# EAGLE design Relay board shield (EAGLE 9.2.0)
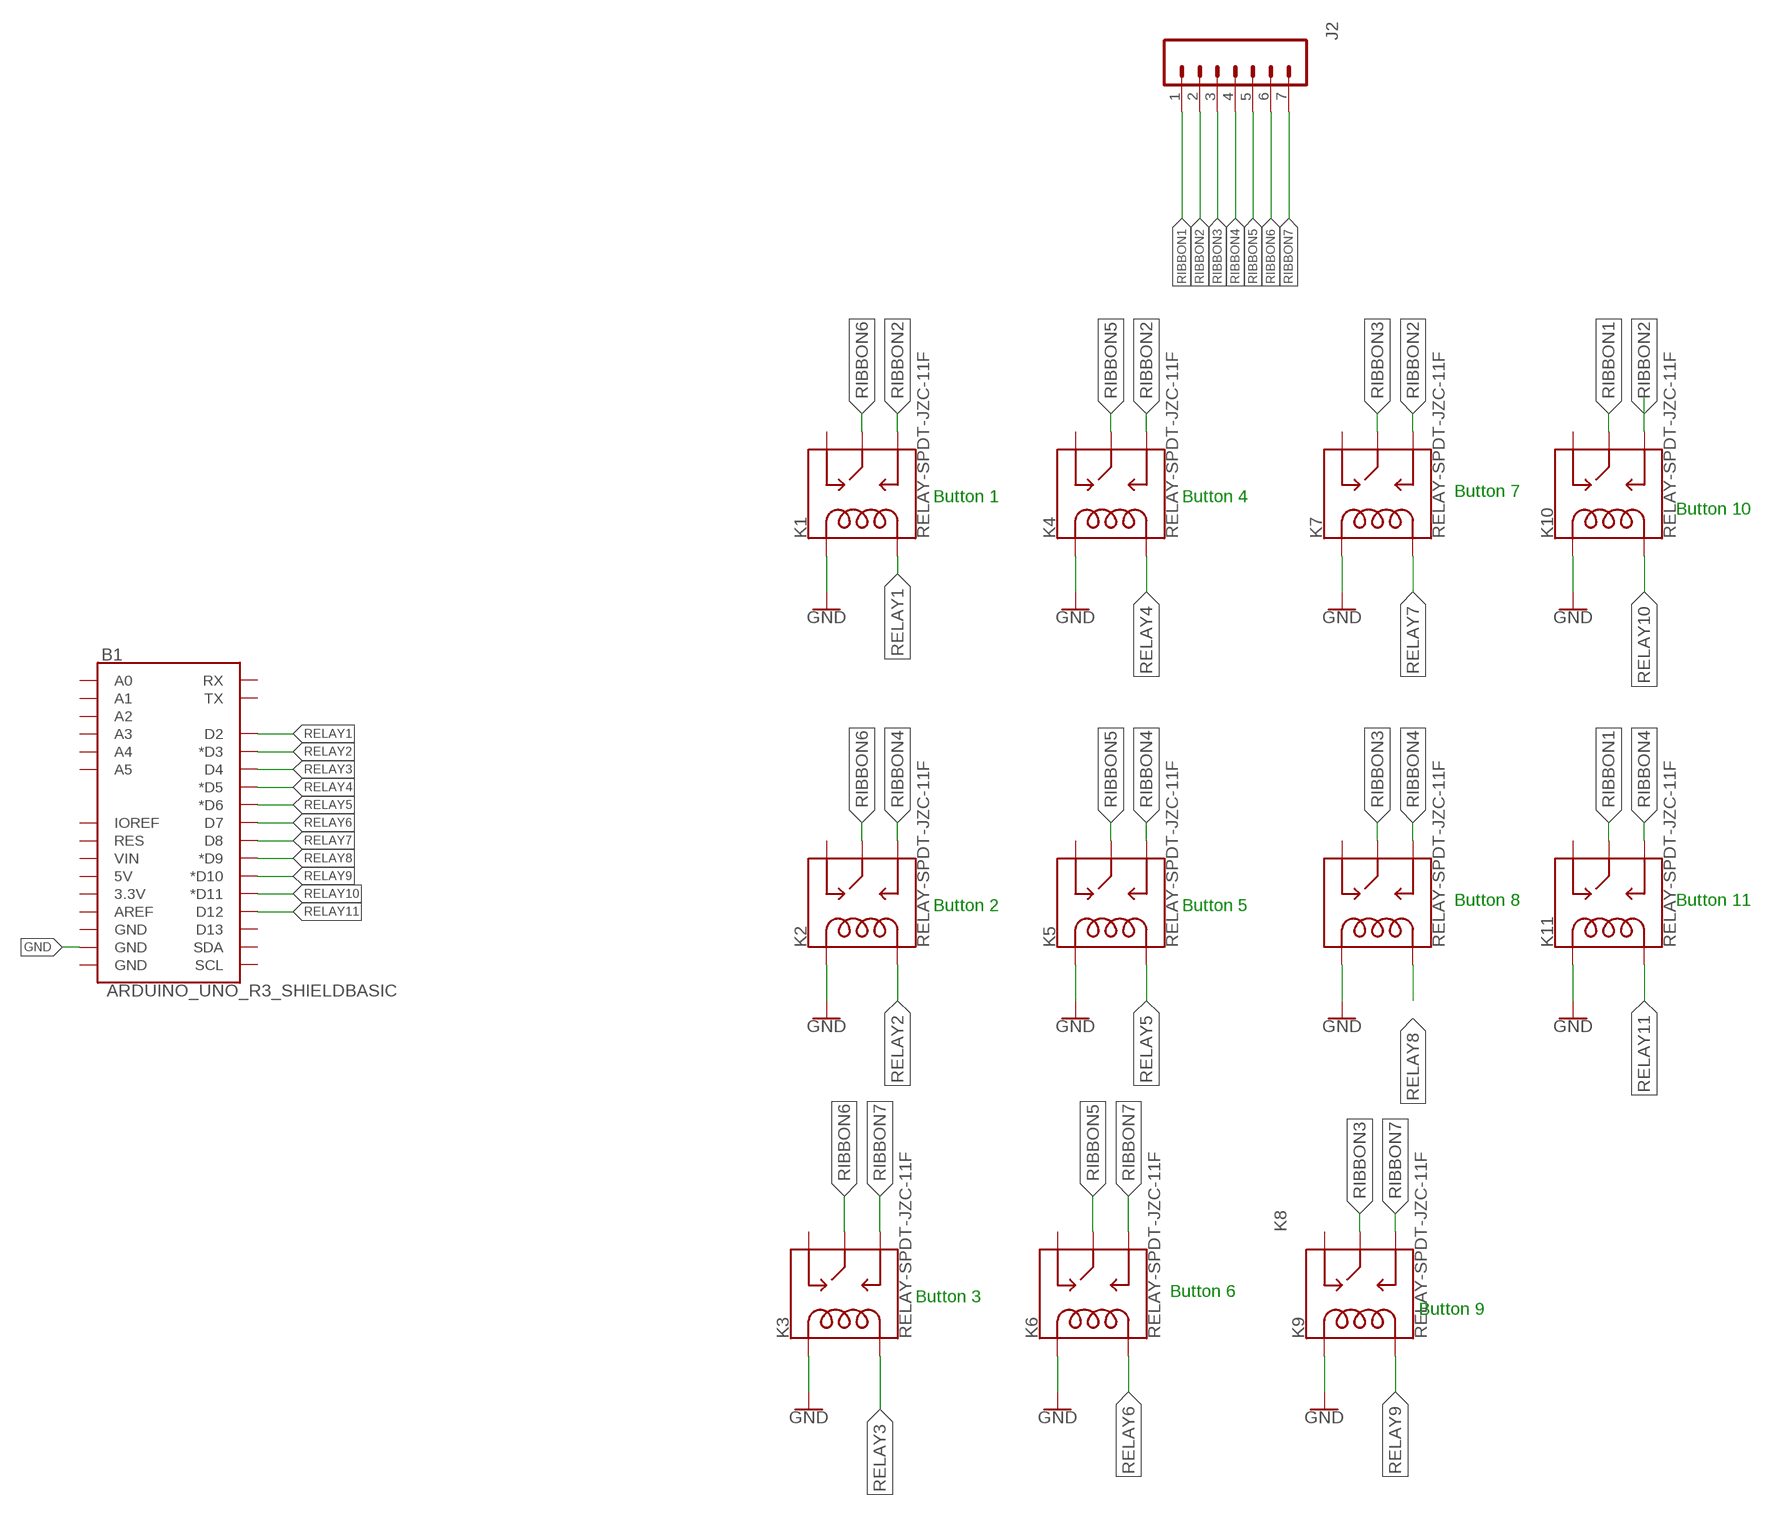
[diagram p0: schematic, sheet 1]

## Parts
B1  ARDUINO_UNO_R3_SHIELDBASIC  [UNO_R3_SHIELD]
J2  CONN_07  [1X07]
K1  RELAY-SPDT-JZC-11F  [RELAY-JZC]
K2  RELAY-SPDT-JZC-11F  [RELAY-JZC]
K3  RELAY-SPDT-JZC-11F  [RELAY-JZC]
K4  RELAY-SPDT-JZC-11F  [RELAY-JZC]
K5  RELAY-SPDT-JZC-11F  [RELAY-JZC]
K6  RELAY-SPDT-JZC-11F  [RELAY-JZC]
K7  RELAY-SPDT-JZC-11F  [RELAY-JZC]
K8  RELAY-SPDT-JZC-11F  [RELAY-JZC]
K9  RELAY-SPDT-JZC-11F  [RELAY-JZC]
K10  RELAY-SPDT-JZC-11F  [RELAY-JZC]
K11  RELAY-SPDT-JZC-11F  [RELAY-JZC]

## Nets
GND: B1.GND@1(GND) K1.5(COIL1) K2.5(COIL1) K3.5(COIL1) K4.5(COIL1) K5.5(COIL1) K6.5(COIL1) K7.5(COIL1) K8.5(COIL1) K9.5(COIL1) K10.5(COIL1) K11.5(COIL1)
RELAY1: B1.D2 K1.1(COIL2)
RELAY2: B1.D3(*D3) K2.1(COIL2)
RELAY3: B1.D4 K3.1(COIL2)
RELAY4: B1.D5(*D5) K4.1(COIL2)
RELAY5: B1.D6(*D6) K5.1(COIL2)
RELAY6: B1.D7 K6.1(COIL2)
RELAY7: B1.D8 K7.1(COIL2)
RELAY8: B1.D9(*D9) K8.1(COIL2)
RELAY9: B1.D10(*D10) K9.1(COIL2)
RELAY10: B1.D11(*D11) K10.1(COIL2)
RELAY11: B1.D12 K11.1(COIL2)
RIBBON1: J2.1 K10.4(MAIN) K11.4(MAIN)
RIBBON2: J2.2 K1.3(NO) K4.3(NO) K7.3(NO) K10.3(NO)
RIBBON3: J2.3 K7.4(MAIN) K8.4(MAIN) K9.4(MAIN)
RIBBON4: J2.4 K2.3(NO) K5.3(NO) K8.3(NO) K11.3(NO)
RIBBON5: J2.5 K4.4(MAIN) K5.4(MAIN) K6.4(MAIN)
RIBBON6: J2.6 K1.4(MAIN) K2.4(MAIN) K3.4(MAIN)
RIBBON7: J2.7 K3.3(NO) K6.3(NO) K9.3(NO)
Unconnected: B1.3.3V B1.5V B1.A0 B1.A1 B1.A2 B1.A3 B1.A4 B1.A5 B1.AREF B1.D13 B1.GND@0(GND) B1.GND@2(GND) B1.IOREF B1.RES B1.RX B1.SCL B1.SDA B1.TX B1.VIN K1.2(NC) K2.2(NC) K3.2(NC) K4.2(NC) K5.2(NC) K6.2(NC) K7.2(NC) K8.2(NC) K9.2(NC) K10.2(NC) K11.2(NC)

## Notes on the sheet
- Button 7
- Button 1 | Button 4 | Button 10
- Button 8 | Button 11
- Button 2 | Button 5
- Button 6
- Button 3 | Button 9

## Library data of the parts
B1 = SparkFun-Boards:ARDUINO_UNO_R3_SHIELD: Arduino R3 Shield Footprint Shield form compatible with the Arduino Uno R3. SparkFun Products: MG2639 Cellular Shield <https://www.sparkfun.com/products/13120> MIDI Shield <https://www.sparkfun.com/products/12898> R3 Stackable Headers Kit <https://www.sparkfun.com/products/11417>
J2 = SparkFun-Connectors:CONN_07: Multi connection point. Often used as Generic Header-pin footprint for 0.1 inch spaced/style header connections On any of the 0.1 inch spaced packages, you can populate with these: Break Away Headers - Straight <https://www.sparkfun.com/products/116> (PRT-00116) Break Away Male Headers - Right Angle <https://www.sparkfun.com/products/553> (PRT-00553) Female Headers <https://www.sparkfun.com/products/115> (PRT-00115) Break Away Headers - Machine Pin <https://www.sparkfun.com/products/117> (PRT-00117) Break Away Female Headers - Swiss Machine Pin <https://www.sparkfun.com/products/743> (PRT-00743) For SCREWTERMINALS and SPRING TERMINALS visit here: Screw Terimnals on SparkFun.com <https://www.sparkfun.com/search/results?term=Screw+Terminals> (5mm/3.5mm/2.54mm spacing) This device is also useful as a general connection point to wire up your design to another part of your project. Our various solder wires solder well into these plated through hole pads. Hook-Up Wire - Assortment (Stranded, 22 AWG) <https://www.sparkfun.com/products/11375> (PRT-11375) Hook-Up Wire - Assortment (Solid Core, 22 AWG) <https://www.sparkfun.com/products/11367> (PRT-11367) View the entire wire category on our website here <https://www.sparkfun.com/categories/141> Special notes: Molex polarized connector foot print use with SKU : PRT-08231 with associated crimp pins and housings. 1MM SMD Version SKU: PRT-10208 NOTES ON THE VARIANTS LOCK and LOCK_LONGPADS... This footprint was designed to help hold the alignment of a through-hole component (i.e. 6-pin header) while soldering it into place. You may notice that each hole has been shifted either up or down by 0.005 of an inch from it's more standard position (which is a perfectly straight line). This slight alteration caused the pins (the squares in the middle) to touch the edges of the holes. Because they are alternating, it causes a "brace" to hold the component in place. 0.005 has proven to be the perfect amount of "off-center" position when using our standard breakaway headers. Although looks a little odd when you look at the bare footprint, once you have a header in there, the alteration is very hard to notice. Also,if you push a header all the way into place, it is covered up entirely on the bottom side.
K1-K11 = SparkFun-Electromechanical:RELAY-SPDT: SPDT Electromechanical Relay Single-pole, double-throw sealed relays. When current is applied to the coil, it throws a simple changeover switch, terminating the connection from the NC contact to ground and closing the NO contact. Use them to switch high voltage/high current devices. SparkFun Products JQX-15F: Relay SPDT Sealed - 20A <https://www.sparkfun.com/products/10924> (COM-10924) JZC-11F: Relay SPDT Sealed <https://www.sparkfun.com/products/100> (COM-00100); PROD_ID: COMP-09533; SF_SKU: COM-00100

## Board
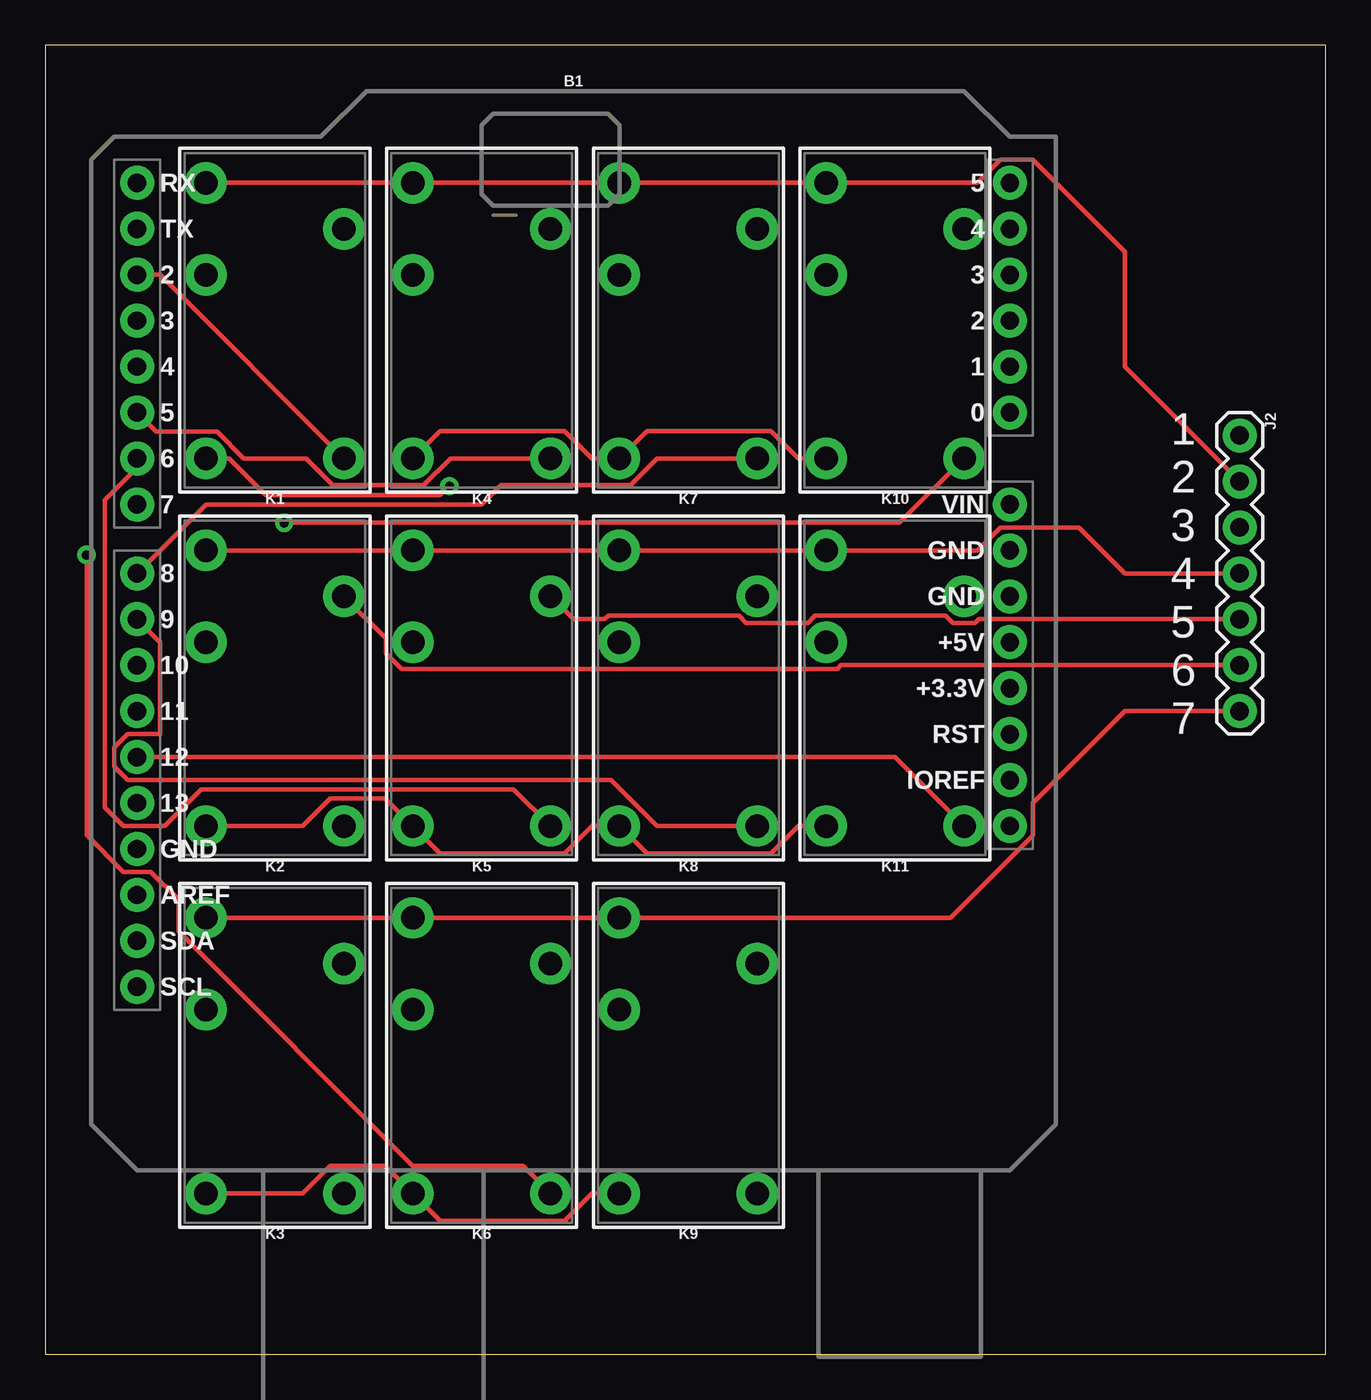
[diagram p1: board, top side]
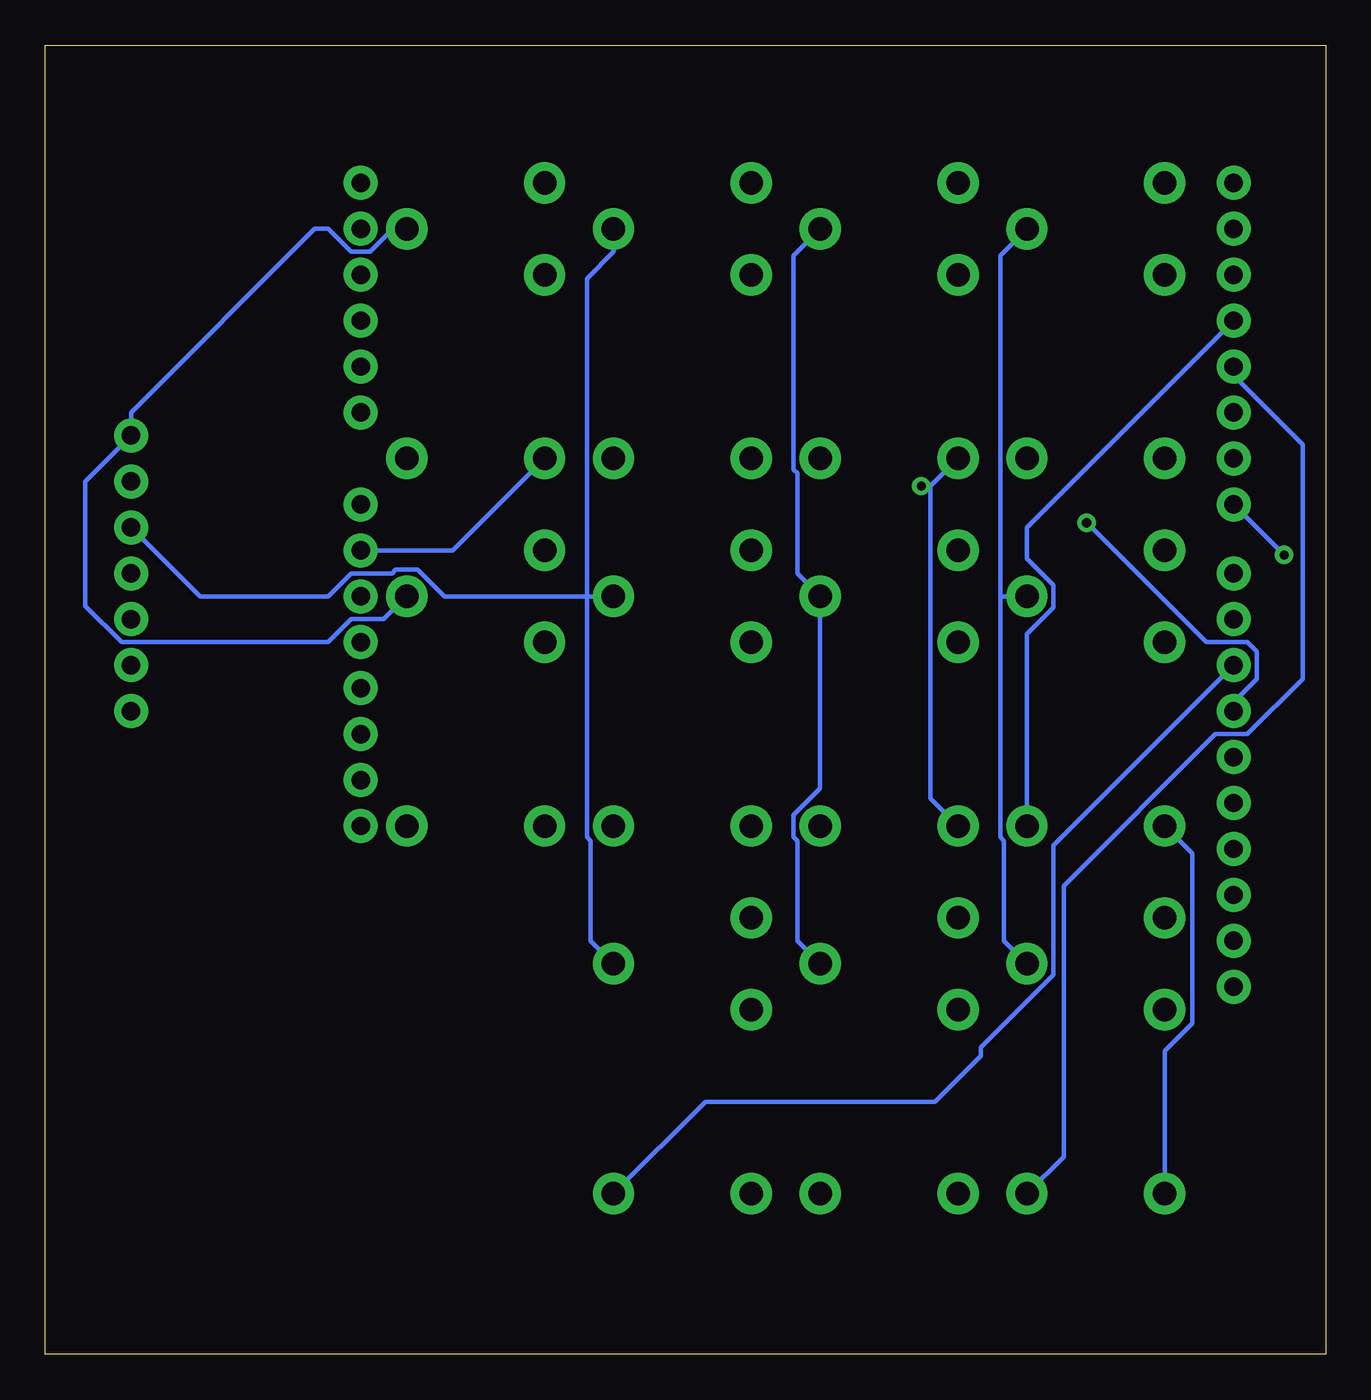
[diagram p2: board, bottom side, seen from below]

Size 70.79 x 72.38 mm. Coordinates in mm from the lower left corner, seen from the top.
Outline: 0,0 70.79,0 70.79,72.38 0,72.38 0,0
Copper layers (1*16): Top 0.035mm / dielectric 1.5mm / Bottom 0.035mm
Design rules "SparkFun-2-layer-STANDARD": minimum track width 10mil, minimum drill 20mil, track to track 10mil, track to pad 8mil, pad to pad 8mil, via to via 10mil, smd to smd 8mil, copper to edge 8mil, drill to drill 8mil, minimum pad ring 10mil, minimum via ring 10mil, stop-mask expansion 4mil, vias tented up to drill 25mil, thermal gap 10mil

### Footprints (pad centres in the part's own frame; a part is rotated, then mirrored left to right if it is on the bottom)
UNO_R3_SHIELD = drill 1.016 pad 1.88: 3.3V 24.13,-2.54; 5V 24.13,0; A0 24.13,12.7; A1 24.13,15.24; A2 24.13,17.78; A3 24.13,20.32; A4 24.13,22.86; A5 24.13,25.4; AREF -24.13,-13.97; D2 -24.13,20.32; D3 -24.13,17.78; D4 -24.13,15.24; D5 -24.13,12.7; D6 -24.13,10.16; D7 -24.13,7.62; D8 -24.13,3.81; D9 -24.13,1.27; D10 -24.13,-1.27; D11 -24.13,-3.81; D12 -24.13,-6.35; D13 -24.13,-8.89; GND@0 24.13,2.54; GND@1 24.13,5.08; GND@2 -24.13,-11.43; IOREF 24.13,-7.62; NC 24.13,-10.16; RES 24.13,-5.08; RX -24.13,25.4; SCL -24.13,-19.05; SDA -24.13,-16.51; TX -24.13,22.86; VIN 24.13,7.62
1X07 = drill 1.016 pad 1.88: 1 0,0; 2 2.54,0; 3 5.08,0; 4 7.62,0; 5 10.16,0; 6 12.7,0; 7 15.24,0
RELAY-JZC = drill 1.3 pad 2.286: 1 3.81,-8.89; 2 -3.81,1.27; 3 -3.81,6.35; 4 3.81,3.81; 5 -3.81,-8.89

### Placement (x,y rotation side)
B1  29.21,39.37 0 top
J2  66.04,50.8 270 top
K1  12.7,58.42 0 top
K2  12.7,38.1 0 top
K3  12.7,17.78 0 top
K4  24.13,58.42 0 top
K5  24.13,38.1 0 top
K6  24.13,17.78 0 top
K7  35.56,58.42 0 top
K8  35.56,38.1 0 top
K9  35.56,17.78 0 top
K10  46.99,58.42 0 top
K11  46.99,38.1 0 top

### Tracks (layer width: path | path; a pad name or v marks a point on that pad's centre or on a via)
GND  (via drill 0.51)
  Top 0.254: K1.5 10.16,49.53 12.19,47.5 21.84,47.5 v22.35,48.01 | K4.5 21.84,51.05 28.7,51.05 30.23,49.53 K7.5 33.27,51.05 40.13,51.05 41.66,49.53 K10.5 | K3.5 14.22,8.89 15.75,10.41 18.8,10.41 K6.5 21.84,7.37 28.7,7.37 30.23,8.89 K9.5 | K2.5 14.22,29.21 15.75,30.73 18.8,30.73 K5.5 21.84,27.69 28.7,27.69 30.23,29.21 K8.5 33.27,27.69 40.13,27.69 41.66,29.21 K11.5
  Bottom 0.254: B1.GND@1 48.26,44.45 K10.5 | v22.35,48.01 21.84,48.01 | 21.84,48.01 K4.5 | K3.5 8.89,16.76 7.37,18.29 7.37,27.69 K2.5 | 21.84,48.01 21.84,30.73 K5.5
RELAY1
  Top 0.254: K1.1 6.35,59.69 B1.D2
RELAY2
  Bottom 0.254: B1.D3 16.51,45.72 16.51,43.99 15.04,42.52 15.04,41.3 16.51,39.83 K2.1
RELAY3
  Bottom 0.254: B1.D4 5.08,54.1 1.27,50.29 1.27,43.69 1.27,37.34 4.32,34.29 6.1,34.29 14.48,25.91 14.48,10.92 K3.1
RELAY4
  Top 0.254: K4.1 22.4,49.53 20.93,48.06 15.9,48.06 14.43,49.53 10.97,49.53 9.5,51 6.15,51 B1.D5
RELAY5
  Top 0.254: B1.D6 5.08,49.02 3.3,47.24 3.3,30.23 4.32,29.21 6.6,29.21 8.64,31.24 25.91,31.24 K5.1
RELAY6  (via drill 0.51)
  Top 0.254: v2.29,44.2 2.29,28.7 4.32,26.67 5.84,26.67 7.37,25.15 7.37,23.37 20.32,10.41 26.42,10.41 K6.1
  Bottom 0.254: B1.D7 v2.29,44.2
RELAY7
  Top 0.254: K7.1 33.83,49.53 32.36,48.06 25.2,48.06 24.13,46.99 8.89,46.99 B1.D8
RELAY8
  Top 0.254: B1.D9 6.36,39.36 6.36,34.29 4.55,34.29 3.81,33.55 3.81,32.49 4.55,31.75 31.29,31.75 33.83,29.21 K8.1
RELAY9
  Bottom 0.254: B1.D10 15.04,28.14 15.04,20.98 19.05,16.97 19.05,16.51 21.59,13.97 34.29,13.97 K9.1
RELAY10  (via drill 0.51)
  Top 0.254: v13.21,45.97 47.24,45.97 K10.1
  Bottom 0.254: B1.D11 5.08,36.07 3.81,37.34 3.81,38.86 4.32,39.37 6.6,39.37 v13.21,45.97
RELAY11
  Top 0.254: B1.D12 46.99,33.02 K11.1
RIBBON1
  Bottom 0.254: K10.4 51.54,62.23 52.81,60.96 53.87,60.96 55.14,62.23 55.88,62.23 66.04,52.07 J2.1 68.58,48.26 68.58,41.38 66.57,39.37 55.14,39.37 53.87,40.64 52.07,40.64 K11.4
RIBBON2
  Top 0.254: K1.3 K4.3 K7.3 K10.3 51.54,64.77 52.81,66.04 54.61,66.04 59.69,60.96 59.69,54.61 J2.2
RIBBON3
  Bottom 0.254: K7.4 39.37,60.96 40.84,59.49 40.84,41.91 | 40.84,41.91 40.84,28.6 40.64,28.4 40.64,22.86 K9.4 | 40.84,41.91 K8.4 48.72,41.91 50.19,43.38 51.41,43.38 51.61,43.18 53.87,43.18 55.14,41.91 62.23,41.91 J2.3
RIBBON4
  Top 0.254: K2.3 K5.3 K8.3 K11.3 51.54,44.45 52.81,45.72 57.15,45.72 59.69,43.18 J2.4
RIBBON5
  Top 0.254: K5.4 29.21,40.64 30.94,40.64 31.14,40.84 38.35,40.84 38.76,40.44 42.16,40.44 42.57,40.84 49.78,40.84 50.19,40.44 51.41,40.44 51.61,40.64 J2.5
  Bottom 0.254: K4.4 29.41,60.76 29.41,48.92 29.21,48.72 29.21,43.18 K5.4 27.94,31.29 29.41,29.82 29.41,28.6 29.21,28.4 29.21,22.86 K6.4
RIBBON6
  Top 0.254: K2.4 18.85,39.57 18.85,38.76 19.71,37.9 43.79,37.9 43.99,38.1 J2.6
  Bottom 0.254: 17.98,41.91 17.98,60.76 K1.4 | 17.98,41.91 17.98,28.6 17.78,28.4 17.78,22.86 K3.4 | 17.98,41.91 K2.4
RIBBON7
  Top 0.254: K3.3 K6.3 K9.3 50.06,24.13 54.61,28.68 54.61,30.48 59.69,35.56 J2.7

### Text on the board
tPlace: 1 / 2 / 3 / 4 / 5 / 6 / 7